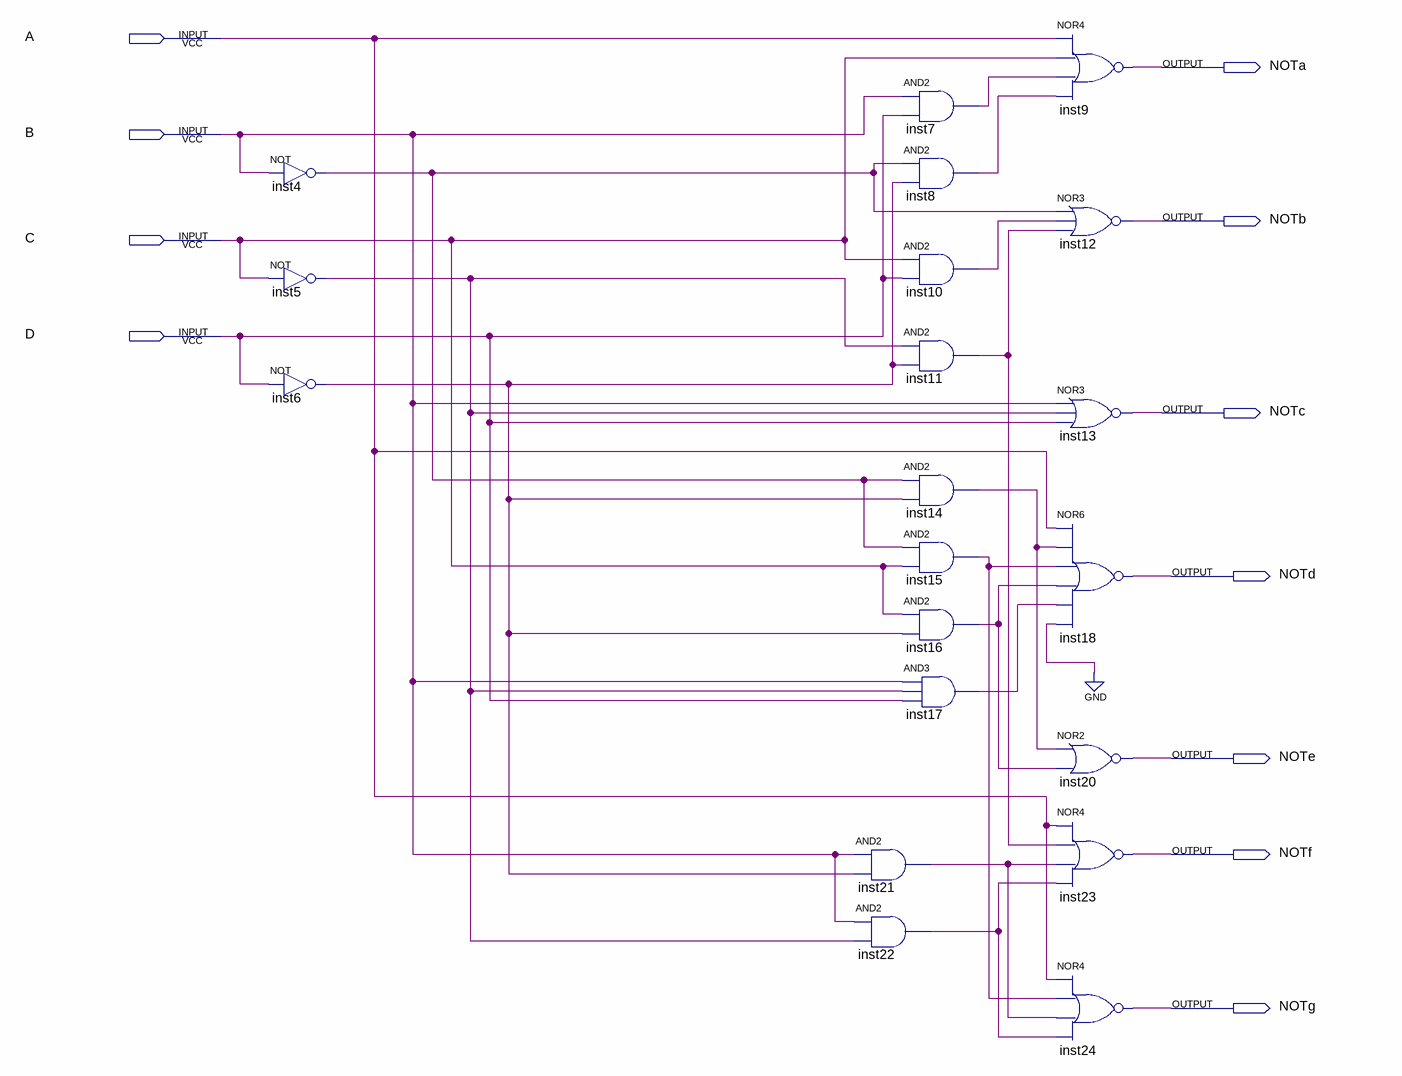
[diagram p0: schematic sheet]
// Quartus schematic BCD_TO_Seven_Segment.bdf as structural Verilog: 20 symbols, 11 pins
module BCD_TO_Seven_Segment (
  input  A,
  input  B,
  input  C,
  input  D,
  output NOTa,
  output NOTb,
  output NOTc,
  output NOTd,
  output NOTe,
  output NOTf,
  output NOTg
);

  wire inst4_out, inst5_out, inst6_out, inst7_out, inst8_out, inst10_out, inst11_out, inst14_out, inst15_out,
       inst16_out, inst17_out, inst21_out, inst22_out;

  not inst4 (inst4_out, B);
  not inst5 (inst5_out, C);
  not inst6 (inst6_out, D);
  and inst7 (inst7_out, B, D);
  and inst8 (inst8_out, inst4_out, inst6_out);
  and inst10 (inst10_out, C, D);
  and inst11 (inst11_out, inst5_out, inst6_out);
  and inst14 (inst14_out, inst4_out, inst6_out);
  and inst15 (inst15_out, inst4_out, C);
  and inst16 (inst16_out, C, inst6_out);
  and inst17 (inst17_out, B, inst5_out, D);
  and inst21 (inst21_out, B, inst6_out);
  and inst22 (inst22_out, B, inst5_out);
  nor inst9 (NOTa, A, C, inst7_out, inst8_out);
  nor inst12 (NOTb, inst4_out, inst10_out, inst11_out);
  nor inst13 (NOTc, B, inst5_out, D);
  nor inst18 (NOTd, A, inst14_out, inst15_out, inst16_out, inst17_out, 1'b0);
  nor inst20 (NOTe, inst14_out, inst16_out);
  nor inst23 (NOTf, A, inst11_out, inst21_out, inst22_out);
  nor inst24 (NOTg, A, inst15_out, inst21_out, inst22_out);
endmodule
